# EAGLE design mainboard (EAGLE 7.2.0)
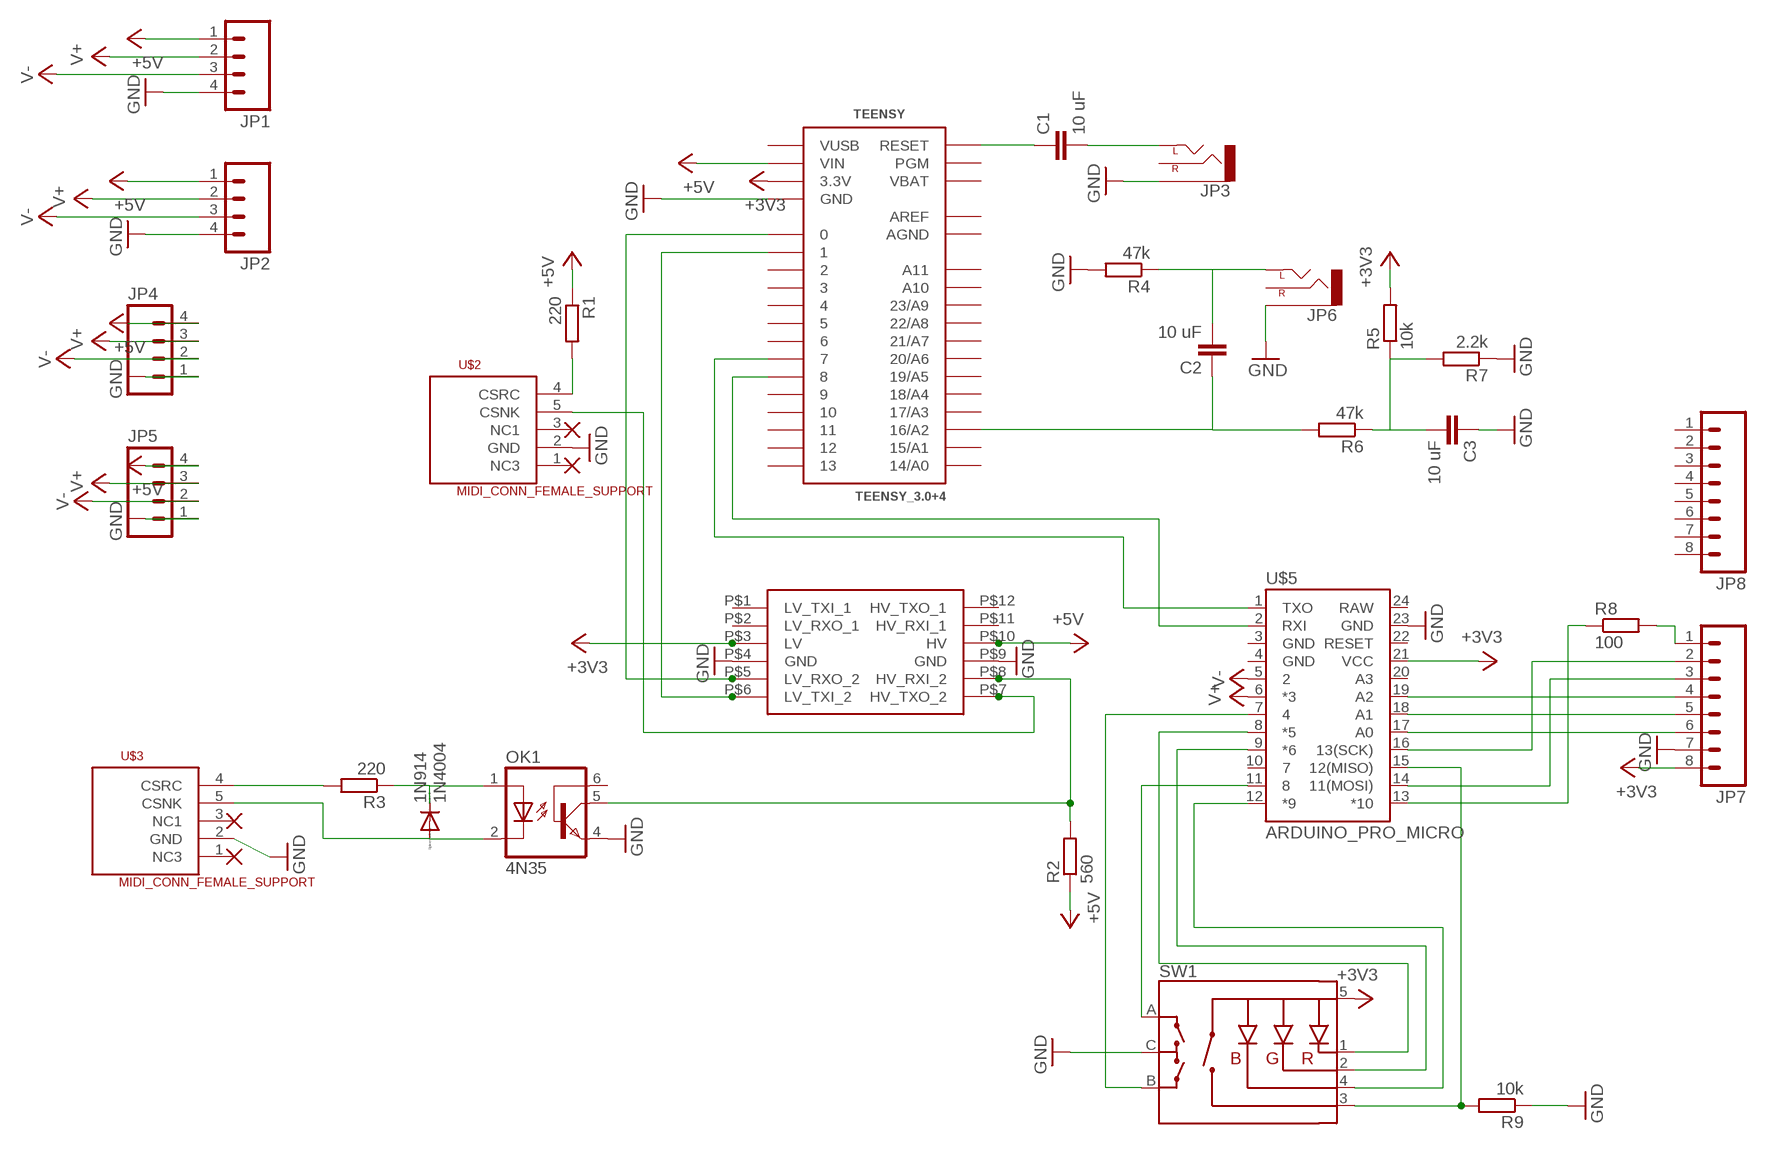
[diagram p0: schematic, sheet 1]

## Parts
1N914  1N4004  [DO41-10]
C1  10 uF  CAPPTH  [CAP-PTH-SMALL]
C2  10 uF  CAPPTH  [CAP-PTH-SMALL]
C3  10 uF  CAPPTH  [CAP-PTH-SMALL]
JP1  M04PTH  [1X04]
JP2  M04PTH  [1X04]
JP3  AUDIO-JACKPTH  [AUDIO-JACK]
JP4  M04PTH  [1X04]
JP5  M04PTH  [1X04]
JP6  AUDIO-JACKPTH  [AUDIO-JACK]
JP7  M08  [1X08_ROUND]
JP8  M08  [1X08_ROUND]
OK1  4N35  [DIL06]
R1  220  R-EU_0204/5  [0204/5]
R2  560  R-EU_0204/5  [0204/5]
R3  220  R-EU_0204/5  [0204/5]
R4  47k  R-EU_0204/5  [0204/5]
R5  10k  R-EU_0204/5  [0204/5]
R6  47k  R-EU_0204/5  [0204/5]
R7  2.2k  R-EU_0204/5  [0204/5]
R8  100  R-EU_0204/5  [0204/5]
R9  10k  R-EU_0204/5  [0204/5]
SW1  ENCODER_RGB_CA  [ENCODER_LED_3]
TEENSY  TEENSY_3.0+4  [TEENSY_3.0+4]
U$2  MIDI_CONN_FEMALE_SUPPORT  [DIN_5_FEMALE_SUPPORT]
U$3  MIDI_CONN_FEMALE_SUPPORT  [DIN_5_FEMALE_SUPPORT]
U$4  LOGIC_LEVEL_CONVERTER  [LOGIC_LEVEL_CONVERTER]
U$5  ARDUINO_PRO_MICRO  [ARDUINO_PRO_MICRO]

## Nets
+3V3: JP7.8 R5.2 SW1.5(+) TEENSY.3.3V TEENSY.3.3V1(3.3V) U$4.P$3(LV) U$5.21(VCC)
+5V: JP1.1 JP2.1 JP4.4 JP5.4 R1.1 R2.1 TEENSY.VIN U$4.P$10(HV)
GND: C3.1 JP1.4 JP2.4 JP3.SLEEVE JP4.1 JP5.1 JP6.SLEEVE JP7.7 OK1.4(EMI) R4.2 R7.1 R9.1 SW1.C TEENSY.GND TEENSY.GND1(GND) U$2.2(GND) U$3.2(GND) U$4.P$4(GND) U$4.P$9(GND) U$5.23(GND)
N$1: C1.1 TEENSY.RESET
N$2: OK1.5(COL) R2.2 U$4.P$8(HV_RXI_2)
N$3: JP7.1 R8.2
N$4: C1.2 JP3.TIP(LEFT)
N$5: C2.2 JP6.TIP(LEFT) R4.1
N$6: C2.1 R6.2 TEENSY.16/A2
N$7: C3.2 R5.1 R6.1 R7.2
N$8: R3.2 U$3.4(CSRC)
N$9: SW1.2(-G) U$5.9(*6)
N$10: TEENSY.7 U$5.1(TXO)
N$11: TEENSY.8 U$5.2(RXI)
N$12: SW1.1(-R) U$5.8(*5)
N$14: SW1.A U$5.11
N$15: U$2.5(CSNK) U$4.P$7(HV_TXO_2)
N$16: TEENSY.1 U$4.P$6(LV_TXI_2)
N$17: TEENSY.0 U$4.P$5(LV_RXO_2)
N$18: 1N914.A OK1.2(C) U$3.5(CSNK)
N$19: 1N914.C OK1.1(A) R3.1
N$20: SW1.B U$5.7
N$21: R9.2 SW1.3(SW) U$5.15(12(MISO))
N$22: R8.1 U$5.13(*10)
N$23: JP7.2 U$5.16(13(SCK))
N$24: R1.2 U$2.4(CSRC)
N$25: JP7.3 U$5.14(11(MOSI))
N$26: SW1.4(-B) U$5.12(*9)
N$28: JP7.6 U$5.17(A0)
N$29: JP7.5 U$5.18(A1)
N$30: JP7.4 U$5.19(A2)
V+: JP1.2 JP2.2 JP4.3 JP5.3 U$5.6(*3)
V-: JP1.3 JP2.3 JP4.2 JP5.2 U$5.5
Unconnected: JP3.RING(RIGHT) JP6.RING(RIGHT) JP8.1 JP8.2 JP8.3 JP8.4 JP8.5 JP8.6 JP8.7 JP8.8 OK1.6(BAS) TEENSY.2 TEENSY.3 TEENSY.4 TEENSY.5 TEENSY.6 TEENSY.9 TEENSY.10 TEENSY.11 TEENSY.12 TEENSY.13 TEENSY.14/A0 TEENSY.15/A1 TEENSY.17/A3 TEENSY.18/A4 TEENSY.19/A5 TEENSY.20/A6 TEENSY.21/A7 TEENSY.22/A8 TEENSY.23/A9 TEENSY.A10 TEENSY.A11 TEENSY.PGM U$2.1(NC3) U$2.3(NC1) U$3.1(NC3) U$3.3(NC1) U$4.P$1(LV_TXI_1) U$4.P$2(LV_RXO_1) U$4.P$11(HV_RXI_1) U$4.P$12(HV_TXO_1) U$5.3(GND) U$5.4(GND) U$5.10 U$5.20(A3) U$5.22(RESET) U$5.24(RAW)

## Power pins joined to a net without a drawn wire
AGND: TEENSY.AGND
AREF: TEENSY.AREF
VBAT: TEENSY.VBAT
VUSB: TEENSY.VUSB

## Library data of the parts
1N914 = diode:1N4004: DIODE general purpose rectifier, 1 A
C1-C3 = SparkFun-Passives:CAP: Capacitor Standard 0603 ceramic capacitor, and 0.1" leaded capacitor.
JP1 JP2 JP4 JP5 = SparkFun-Connectors:M04: Header 4 Standard 4-pin 0.1" header. Use with straight break away headers (SKU : PRT-00116), right angle break away headers (PRT-00553), swiss pins (PRT-00743), machine pins (PRT-00117), and female headers (PRT-00115). Molex polarized connector foot print use with SKU : PRT-08231 with associated crimp pins and housings. 1MM SMD Version SKU: PRT-10208
JP3 JP6 = SparkFun-Connectors:AUDIO-JACK: 3.5mm Audio Jack Simple 3.5mm common PCB mount audio jack. Variant PTH is our storefront SKU PRT-08032
JP7 JP8 = SparkFun-Connectors:M08: Header 8 Standard 8-pin 0.1" header. Use with straight break away headers (SKU : PRT-00116), right angle break away headers (PRT-00553), swiss pins (PRT-00743), machine pins (PRT-00117), and female headers (PRT-00115).
OK1 = optocoupler:4N35: MOTOROLA OPTO COUPLER; MF: FAIRCHILD SEMICONDUCTOR; MPN: 4N35; OC_FARNELL: 1328375; OC_NEWARK: 72K9946
R1-R9 = resistor:R-EU_: RESISTOR, European symbol
SW1 = SparkFun-Electromechanical:ENCODER_RGB_CA: Illuminated Rotary Encoder w/ RGB LED and select switch EC12PLRGBSDVBF-D: http://top-up.so-buy.com/front/bin/ptdetail.phtml?Part=EC12PLRGBSDVBF-D
TEENSY = Teensy3.0:TEENSY_3.0+4: Teensy 3.0 board, showing all pins that are easily acessible. See 'AllAnalogPins" and 'AllPins' packages for additional pin holes, as needed. The 'Basic' package has fewer pins.
U$2 U$3 = SparkFun-Connectors:MIDI_CONN_FEMALE_SUPPORT: MIDI connector with strain relief (DIN-5 female)
U$4 = SparkFun-Boards:LOGIC_LEVEL_CONVERTER: Logic Level Converter (3.3v - 5v) https://www.sparkfun.com/products/8745
U$5 = SparkFun-Boards:ARDUINO_PRO_MICRO

## Board
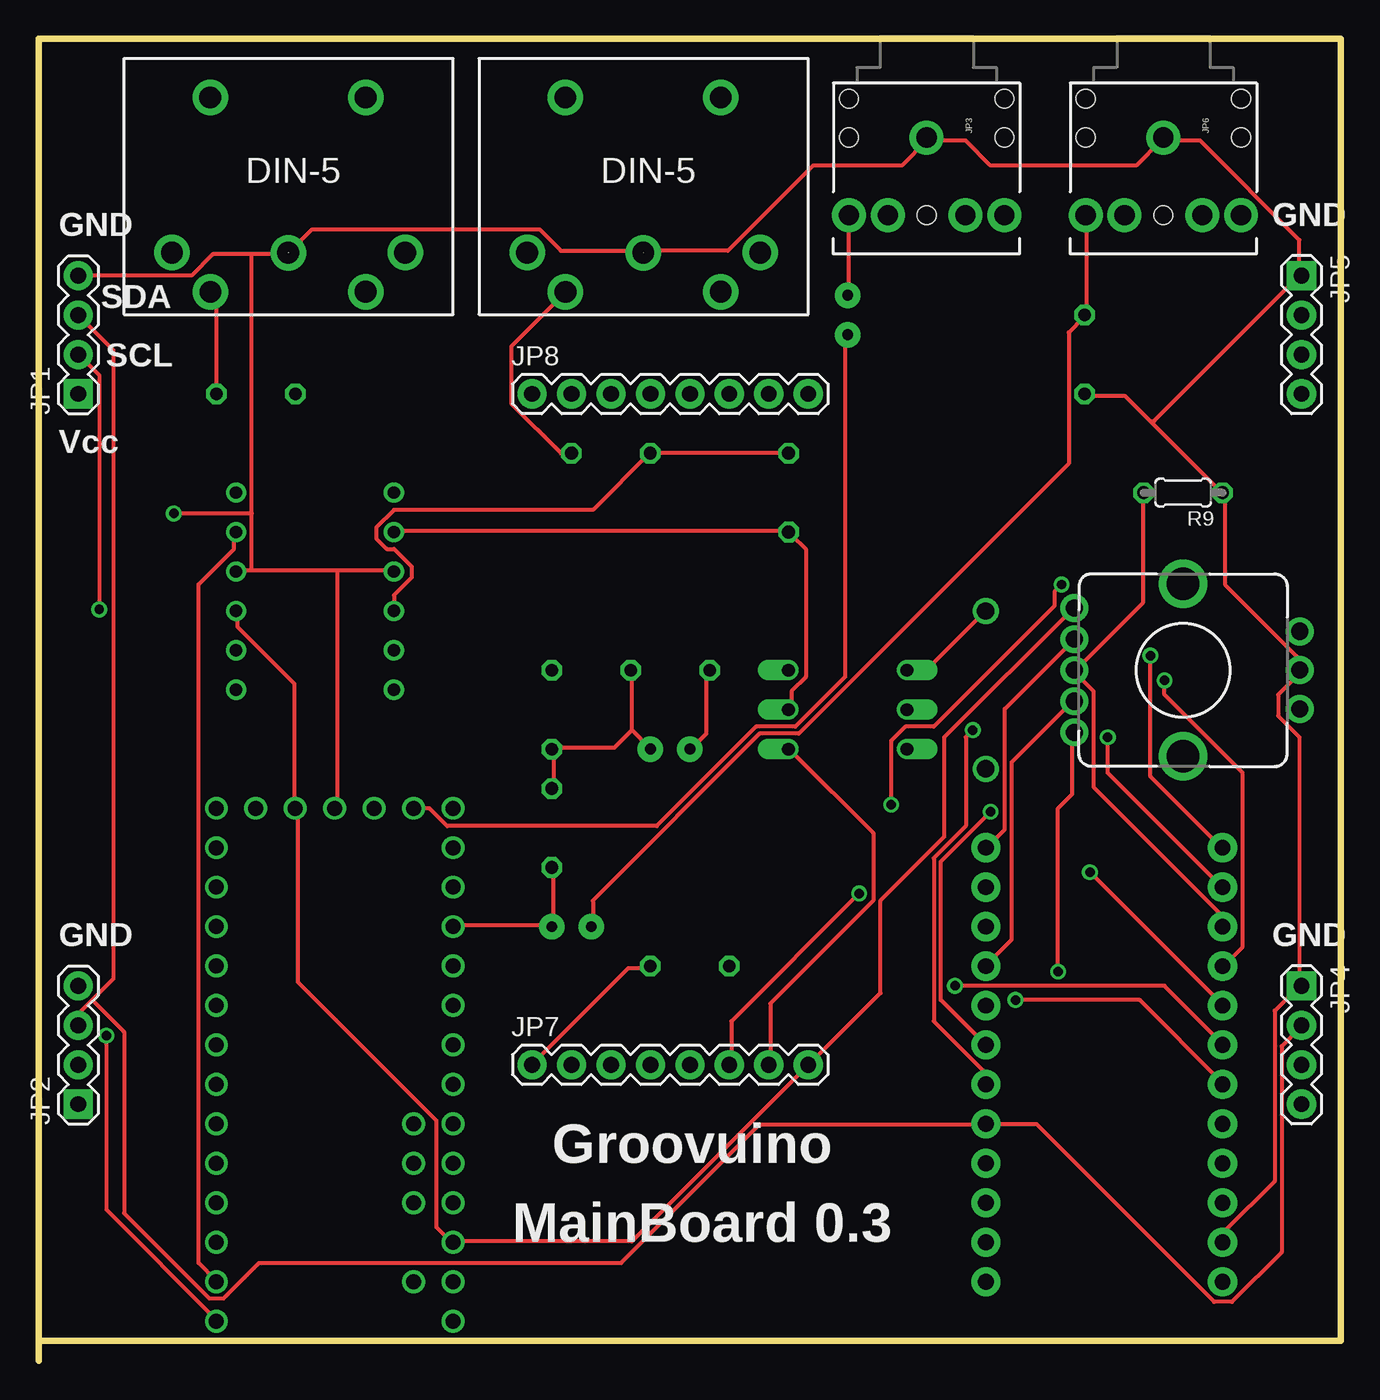
[diagram p1: board, top side]
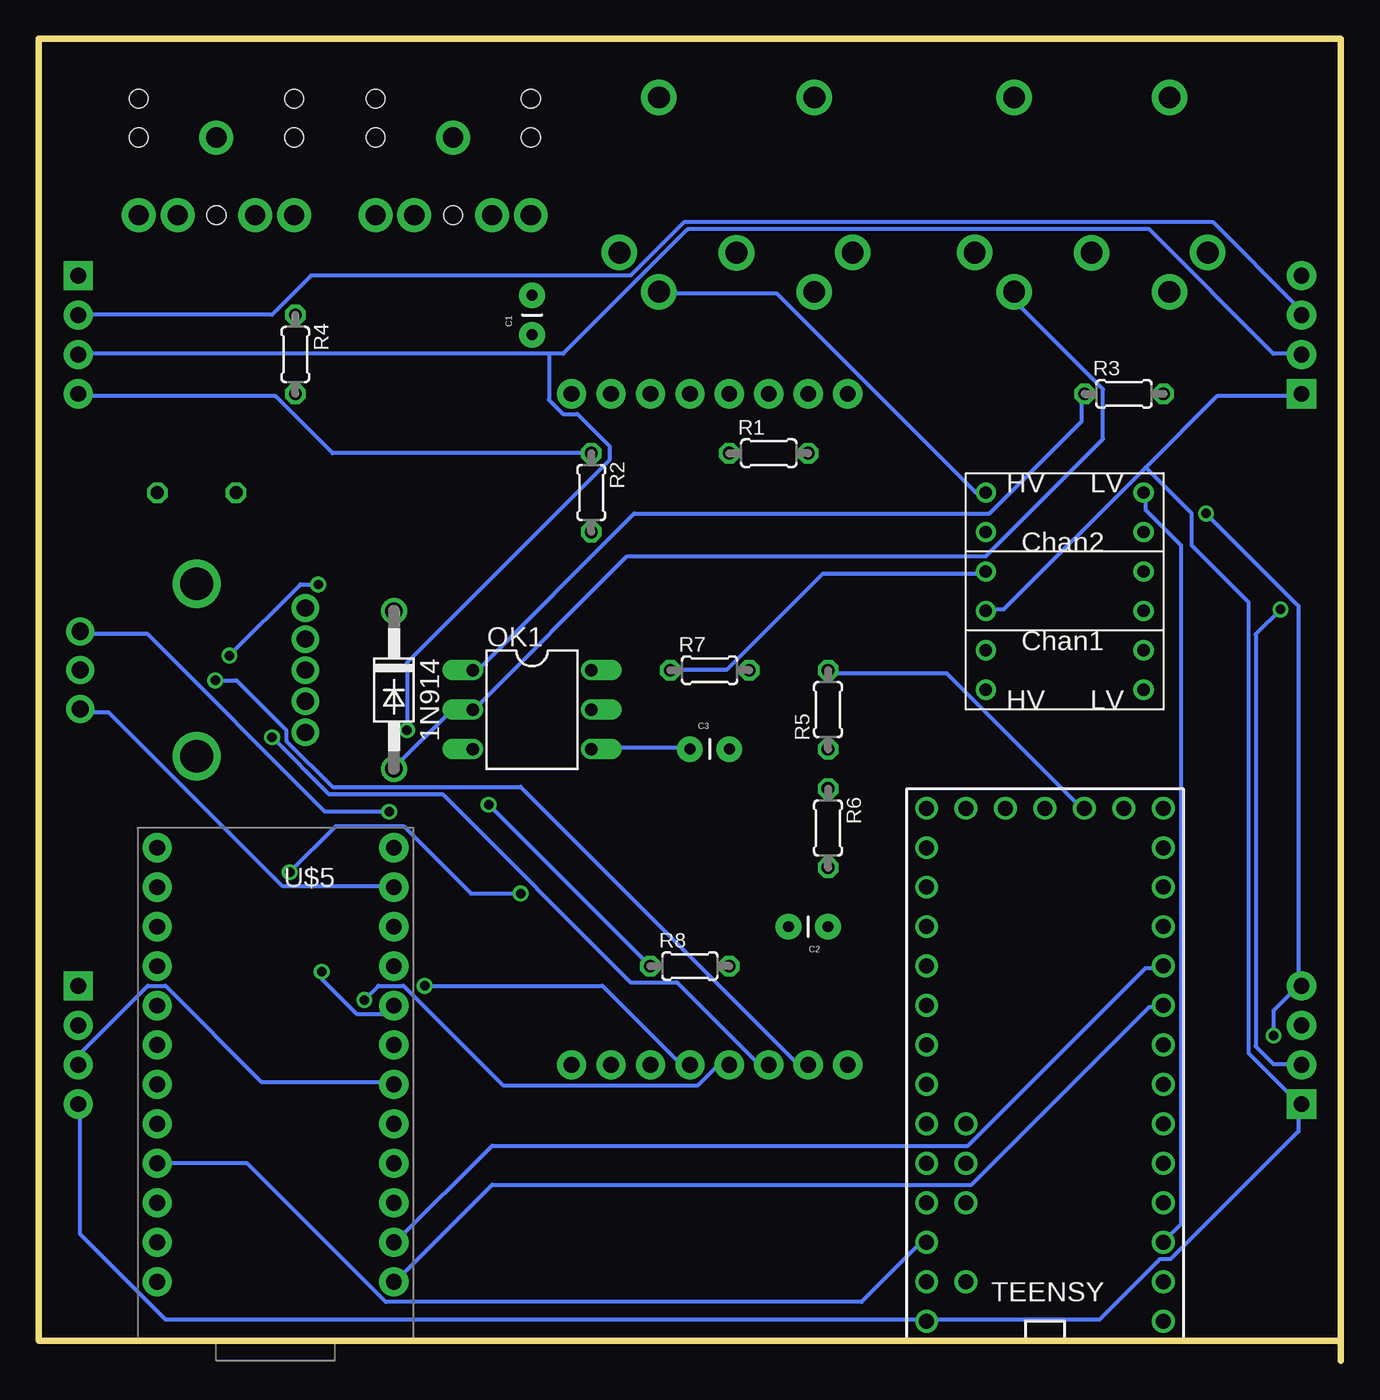
[diagram p2: board, bottom side, seen from below]

Size 83.82 x 85.09 mm. Coordinates in mm from the lower left corner, seen from the top.
Outline: 0,1.27 0,0
Outline: 0,1.27 83.82,1.27 83.82,85.09 0,85.09 0,1.27
Copper layers (1*16): Top 0.035mm / dielectric 1.5mm / Bottom 0.035mm
Design rules "default": minimum track width 10mil, minimum drill 24mil, track to track 8mil, track to pad 8mil, pad to pad 8mil, via to via 8mil, smd to smd 8mil, copper to edge 40mil, drill to drill 8mil, minimum pad ring 10mil, minimum via ring 8mil, stop-mask expansion 4mil, vias tented up to drill 0mil, thermal gap 10mil

### Footprints (pad centres in the part's own frame; a part is rotated, then mirrored left to right if it is on the bottom)
DO41-10 = drill 1.118: A 5.08,0; C -5.08,0
CAP-PTH-SMALL = drill 0.7 pad 1.651: 1 0,0; 2 2.54,0
1X04 = drill 1.016 pad 1.88 square: 1 0,0 | drill 1.016 pad 1.88: 2 2.54,0; 3 5.08,0; 4 7.62,0
AUDIO-JACK = drill 1.3 pad 2.184: RING 5,5; RSH 5,2.5; SLEEVE 0,0; TIP 5,-5; TSH 5,-2.5 | hole 1.2: 0,5; -2.5,5; -2.5,-5; 0,-5; 5,0
1X08_ROUND = drill 1.016 pad 1.88: 1 0,0; 2 2.54,0; 3 5.08,0; 4 7.62,0; 5 10.16,0; 6 12.7,0; 7 15.24,0; 8 17.78,0
DIL06 = drill 0.813 offset: 1 -2.54,-3.81; 2 0,-3.81; 3 2.54,-3.81; 4 2.54,3.81; 5 0,3.81; 6 -2.54,3.81
0204/5 = drill 0.813 octagon: 1 -2.54,0; 2 2.54,0
ENCODER_LED_3 = drill 1.1 pad 1.778: 1 -4,7; 2 -2,7; 3 0,7; 4 2,7; 5 4,7 | drill 1.1 pad 1.8: A -2.5,-7.5; B 2.5,-7.5; C 0,-7.5 | drill 2.1: M1 -5.55,0; M2 5.55,0
TEENSY_3.0+4 = drill 0.965: 0 -7.62,13.97; 1 -7.62,11.43; 2 -7.62,8.89; 3 -7.62,6.35; 3.3V 7.62,11.43; 3.3V1 -2.54,-16.51; 4 -7.62,3.81; 5 -7.62,1.27; 6 -7.62,-1.27; 7 -7.62,-3.81; 8 -7.62,-6.35; 9 -7.62,-8.89; 10 -7.62,-11.43; 11 -7.62,-13.97; 12 -7.62,-16.51; 13 7.62,-16.51; 14/A0 7.62,-13.97; 15/A1 7.62,-11.43; 16/A2 7.62,-8.89; 17/A3 7.62,-6.35; 18/A4 7.62,-3.81; 19/A5 7.62,-1.27; 20/A6 7.62,1.27; 21/A7 7.62,3.81; 22/A8 7.62,6.35; 23/A9 7.62,8.89; A10 5.08,6.35; A11 5.08,3.81; AGND 7.62,13.97; AREF 5.08,8.89; GND -7.62,16.51; GND1 0,-16.51; PGM 2.54,-16.51; RESET 5.08,-16.51; VBAT -5.08,-16.51; VIN 7.62,16.51; VUSB 5.08,13.97
DIN_5_FEMALE_SUPPORT = drill 1.4 pad 2.286: 1 7.94,3.6; 2 0.46,3.61; 3 -7.07,3.6; 4 5.47,6.13; 5 -4.53,6.12; 6 -4.53,-6.382; 7 5.478,-6.382
LOGIC_LEVEL_CONVERTER = drill 0.8: P$1 1.27,13.97; P$2 1.27,11.43; P$3 1.27,8.89; P$4 1.27,6.35; P$5 1.27,3.81; P$6 1.27,1.27; P$7 11.43,1.27; P$8 11.43,3.81; P$9 11.43,6.35; P$10 11.43,8.89; P$11 11.43,11.43; P$12 11.43,13.97
ARDUINO_PRO_MICRO = drill 1.016 pad 1.88: 1 -7.62,12.7; 2 -7.62,10.16; 3 -7.62,7.62; 4 -7.62,5.08; 5 -7.62,2.54; 6 -7.62,0; 7 -7.62,-2.54; 8 -7.62,-5.08; 9 -7.62,-7.62; 10 -7.62,-10.16; 11 -7.62,-12.7; 12 -7.62,-15.24; 13 7.62,-15.24; 14 7.62,-12.7; 15 7.62,-10.16; 16 7.62,-7.62; 17 7.62,-5.08; 18 7.62,-2.54; 19 7.62,0; 20 7.62,2.54; 21 7.62,5.08; 22 7.62,7.62; 23 7.62,10.16; 24 7.62,12.7

### Placement (x,y rotation side)
1N914  60.96,43.18 270 bottom
C1  52.07,66.04 90 bottom
C2  33.02,27.94 180 bottom
C3  41.91,39.37 0 bottom
JP1  2.54,62.23 90 top
JP2  2.54,16.51 90 top
JP3  57.15,78.74 270 top
JP4  81.28,24.13 270 top
JP5  81.28,69.85 270 top
JP6  72.39,78.74 270 top
JP7  31.75,19.05 0 top
JP8  31.75,62.23 0 top
OK1  52.07,41.91 270 bottom
R1  36.83,58.42 0 bottom
R2  48.26,55.88 270 bottom
R3  13.97,62.23 0 bottom
R4  67.31,64.77 270 bottom
R5  33.02,41.91 90 bottom
R6  33.02,34.29 270 bottom
R7  40.64,44.45 0 bottom
R8  41.91,25.4 0 bottom
R9  73.66,55.88 180 top
SW1  73.66,44.45 90 top
TEENSY  19.05,19.05 180 bottom
U$2  39.37,74.93 180 top
U$3  16.51,74.93 180 top
U$4  11.43,57.15 180 bottom
U$5  68.58,17.78 180 bottom

### Tracks (layer width: path | path; a pad name or v marks a point on that pad's centre or on a via)
+3V3
  Top 0.254: U$4.P$3 12.8,48.13 12.8,47.22 16.46,43.56 16.46,35.56 TEENSY.3.3V1 16.69,35.56 16.69,24.36 25.6,15.44 25.6,8.59 26.52,7.67 TEENSY.3.3V 26.75,7.67 38.18,7.67 49.38,18.87 JP7.8 49.61,19.1 54.18,23.67 54.18,29.62 58.29,33.73 58.29,40.13 66.52,48.36 SW1.5
  Bottom 0.254: R5.2 32.92,44.25 25.38,44.25 16.69,35.56 TEENSY.3.3V1 | U$5.21 70.41,12.7 61.49,3.79 30.86,3.79 27.2,7.44 26.75,7.44 TEENSY.3.3V
+5V
  Top 0.254: R2.1 R1.1 39.32,58.42 35.66,54.76 22.86,54.76 21.72,53.62 21.72,52.93 22.4,52.25 22.86,52.25 24,51.11 24,50.42 22.86,49.28 U$4.P$10
  Bottom 0.254: 12.57,57.51 8,62.08 2.74,62.08 JP1.1 | 12.57,57.51 21.72,48.36 22.86,48.36 U$4.P$10 | R2.1 64.92,58.42 68.58,62.08 81.15,62.08 JP5.4 | JP4.4 81.15,16.36 81.15,8.13 75.67,2.64 26.75,2.64 TEENSY.VIN 26.52,2.64 15.54,2.64 11.66,6.53 10.97,6.53 2.74,14.76 2.74,16.36 JP2.1 2.74,16.59 5.94,19.79 5.94,48.82 9.6,52.48 9.6,54.53 12.57,57.51
GND  (via drill 0.61)
  Top 0.254: 57.15,78.54 59.66,78.54 61.27,76.94 70.64,76.94 72.24,78.54 JP6.SLEEVE 72.47,78.54 74.75,78.54 81.15,72.14 81.15,69.85 | 57.15,78.54 55.55,76.94 49.84,76.94 44.35,71.45 39.09,71.45 U$2.2 38.86,71.45 33.6,71.45 32.23,72.82 17.6,72.82 16.23,71.45 U$3.2 16,71.22 13.72,71.22 | 57.15,78.54 JP3.SLEEVE | 81.15,24.13 79.55,22.53 79.55,11.56 76.35,8.36 76.35,7.67 U$5.23 | 71.55,60.48 76.12,55.91 R9.1 76.35,55.68 76.35,49.96 81.15,45.16 81.15,44.48 SW1.C 81.15,44.25 79.78,42.88 79.78,41.5 81.15,40.13 81.15,24.13 | 71.55,60.48 69.95,62.08 67.44,62.08 R4.2 | 81.15,69.85 71.78,60.48 71.55,60.48 | 81.15,24.13 JP4.1 | 81.15,69.85 JP5.1 | R7.1 42.98,44.25 42.98,40.36 42.06,39.45 C3.1 | JP7.7 47.09,19.1 47.09,22.99 53.72,29.62 53.72,33.96 48.46,39.22 OK1.4 | v4.34,20.93 4.34,9.73 11.43,2.64 TEENSY.GND | JP1.4 9.83,69.85 11.2,71.22 13.72,71.22 | 19.2,50.88 22.86,50.88 U$4.P$9 | 19.2,50.88 13.72,50.88 | 13.72,50.88 12.8,50.88 U$4.P$4 | 19.2,50.88 19.2,35.56 TEENSY.GND1 | 13.72,50.88 13.72,54.53 | 13.72,54.53 13.72,71.22 | 13.72,54.53 v8.69,54.53
  Bottom 0.254: OK1.4 48.23,39.45 42.06,39.45 C3.1 | v4.34,20.93 4.34,22.53 2.74,24.13 | 2.74,24.13 2.74,48.59 v8.69,54.53 | 2.74,24.13 JP2.4 | R7.1 42.98,44.48 39.55,44.48 33.38,50.65 22.86,50.65 U$4.P$9
N$1
  Top 0.254: TEENSY.RESET 25.15,35.56 26.29,34.42 39.78,34.42 46.18,40.82 48.69,40.82 51.89,44.02 51.89,65.96 C1.1
N$2
  Top 0.254: U$4.P$8 22.86,53.39 48.23,53.39 R2.2 48.46,53.16 49.38,52.25 49.38,44.02 48.46,43.1 48.46,41.96 OK1.5
N$3
  Top 0.254: R8.2 39.32,25.27 37.95,25.27 31.77,19.1 JP7.1
N$4
  Top 0.254: C1.2 52.12,68.71 52.12,73.74 JP3.TIP
N$5
  Top 0.254: JP6.TIP 67.44,73.74 67.44,67.33 R4.1 67.21,67.11 66.29,66.19 66.29,57.73 48.92,40.36 46.41,40.36 35.66,29.62 35.66,28.02 C2.2
N$6
  Top 0.254: R6.2 33.15,31.67 33.15,28.02 C2.1 32.92,28.02 26.75,28.02 TEENSY.16/A2
N$7
  Top 0.254: R6.1 33.15,36.93 33.15,39.22 R5.1 33.15,39.45 37.03,39.45 38.18,40.59 | 38.18,40.59 38.18,44.25 R7.2 | 38.18,40.59 39.32,39.45 C3.2
N$8
  Top 0.254: R3.2 11.43,68.48 11.2,68.71 U$3.4
N$9
  Top 0.254: SW1.2 66.52,42.42 62.64,38.53 62.64,27.1 61.04,25.5 U$5.9
N$10
  Bottom 0.254: TEENSY.7 11.43,22.76 12.34,22.76 23.77,11.33 54.63,11.33 60.81,5.16 U$5.1
N$11
  Bottom 0.254: TEENSY.8 11.43,25.27 12.57,25.27 24,13.84 54.63,13.84 60.81,7.67 U$5.2
N$12  (via drill 0.61)
  Top 0.254: v65.61,25.04 65.61,35.56 66.52,36.47 66.52,40.36 SW1.1
  Bottom 0.254: v65.61,25.04 65.61,24.59 63.32,22.3 61.49,22.3 61.04,22.76 U$5.8
N$14
  Bottom 0.254: SW1.A 81.15,41.73 79.32,41.73 68.12,30.53 61.04,30.53 U$5.11
N$15
  Bottom 0.254: U$4.P$7 22.86,55.91 23.55,55.91 36.35,68.71 43.89,68.71 U$2.5
N$16
  Bottom 0.254: U$4.P$6 12.57,55.68 12.57,54.76 10.29,52.48 10.29,8.81 11.43,7.67 TEENSY.1
N$17
  Top 0.254: U$4.P$5 12.57,53.16 12.57,52.25 10.29,49.96 10.29,6.3 11.43,5.16 TEENSY.0
N$18
  Bottom 0.254: 1N914.A 60.81,38.3 57.38,41.73 56.01,41.73 OK1.2 55.78,41.96 45.95,51.79 22.86,51.79 15.32,59.33 15.32,62.54 21.03,68.25 21.03,68.71 U$3.5
N$19
  Top 0.254: OK1.1 56.01,44.48 57.15,44.48 60.81,48.13 1N914.C
  Bottom 0.254: R3.1 16.69,62.08 16.69,60.48 22.63,54.53 45.49,54.53 55.78,44.25 OK1.1
N$20  (via drill 0.61)
  Top 0.254: v61.27,35.33 58.06,32.13 58.06,23.22 U$5.7
  Bottom 0.254: v61.27,35.33 65.38,35.33 76.81,46.76 81.15,46.76 SW1.B
N$21
  Top 0.254: R9.2 71.09,55.68 71.09,48.82 66.75,44.48 SW1.3 66.75,44.25 67.89,43.1 67.89,36.93 76.12,28.7 76.12,28.02 U$5.15
N$22  (via drill 0.61)
  Top 0.254: v54.86,35.79 54.86,39.9 55.78,40.82 57.61,40.82 65.38,48.59 65.38,49.51 v65.84,49.96 | v71.55,45.39 71.55,37.62 76.12,33.05 U$5.13
  Bottom 0.254: v54.86,35.79 44.58,25.5 R8.1 | v65.84,49.96 66.98,49.96 v71.55,45.39
N$23  (via drill 0.61)
  Top 0.254: v72.47,43.79 72.47,42.88 77.5,37.85 77.5,26.64 76.35,25.5 U$5.16
  Bottom 0.254: v72.47,43.79 71.09,43.79 67.89,40.59 67.89,39.9 64.92,36.93 52.81,36.93 34.98,19.1 34.29,19.1 JP7.2
N$24
  Top 0.254: R1.2 33.6,58.42 30.4,61.62 30.4,65.28 33.83,68.71 U$2.4
N$25  (via drill 0.61)
  Top 0.254: v68.81,40.13 68.81,37.85 76.12,30.53 U$5.14
  Bottom 0.254: v68.81,40.13 65.15,36.47 57.84,36.47 45.72,24.36 42.75,24.36 37.49,19.1 37.03,19.1 JP7.3
N$26
  Top 0.254: SW1.4 66.52,46.3 62.18,41.96 62.18,34.19 61.04,33.05 U$5.12
N$28  (via drill 0.61)
  Top 0.254: v52.81,30.07 44.58,21.84 44.58,19.1 JP7.6 | v67.67,31.45 76.12,22.99 U$5.17
  Bottom 0.254: v52.81,30.07 56.01,30.07 60.35,34.42 64.69,34.42 v67.67,31.45
N$29  (via drill 0.61)
  Top 0.254: v58.98,24.13 72.47,24.13 76.12,20.47 U$5.18
  Bottom 0.254: v58.98,24.13 47.55,24.13 42.52,19.1 42.06,19.1 JP7.5
N$30  (via drill 0.61)
  Top 0.254: v62.87,23.22 70.87,23.22 76.12,17.96 U$5.19
  Bottom 0.254: v62.87,23.22 61.95,24.13 60.35,24.13 53.95,17.73 41.38,17.73 40.23,18.87 39.55,18.87 JP7.4
V+  (via drill 0.61)
  Top 0.254: v3.89,48.36 3.89,63.45 2.74,64.59 JP1.2 | v60.12,40.59 59.66,40.13 59.66,34.42 57.61,32.36 57.61,21.84 60.81,18.64 60.81,17.96 U$5.6
  Bottom 0.254: U$5.6 61.04,17.96 69.49,17.96 75.67,24.13 76.81,24.13 81.15,19.79 81.15,19.1 JP4.3 | v3.89,48.36 5.49,46.76 5.49,20.24 4.34,19.1 2.74,19.1 JP2.2 | 50.98,64.82 50.06,64.82 42.06,72.82 12.34,72.82 4.34,64.82 2.74,64.82 JP1.2 | 50.98,64.82 81.15,64.82 JP5.3 | v60.12,40.59 60.12,44.93 47.09,57.96 47.09,58.88 49.15,60.94 50.06,60.94 50.98,61.85 50.98,64.82
V-
  Top 0.254: JP4.2 81.15,21.39 80.01,20.24 80.01,6.98 76.81,3.79 75.67,3.79 64.24,15.21 61.04,15.21 U$5.5 60.81,15.21 46.41,15.21 37.49,6.3 14.17,6.3 11.89,4.01 10.97,4.01 5.49,9.5 5.49,21.16 3.43,23.22 | 3.43,23.22 4.8,24.59 4.8,65.05 JP1.3 | 3.43,23.22 2.74,22.53 2.74,21.61 JP2.3
  Bottom 0.254: JP5.2 81.15,67.33 68.81,67.33 66.29,69.85 45.72,69.85 42.29,73.28 8.23,73.28 2.74,67.79 2.74,67.33 JP1.3

### Text on the board
tPlace: GND | GND | SDA | SCL | Vcc | GND | GND | Groovuino | MainBoard 0.3